# EAGLE schematic Crystal Filter (EAGLE 9.1.2)
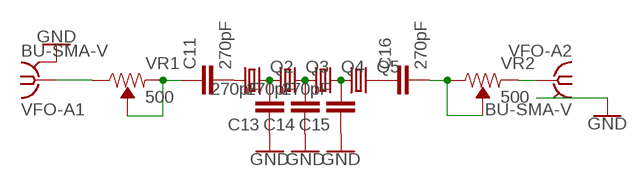
[diagram p0: schematic, sheet 1]

## Parts
C11  270pF  C5/3.5  [C5B3.5]
C13  270pF  C5/3.5  [C5B3.5]
C14  270pF  C5/3.5  [C5B3.5]
C15  270pF  C5/3.5  [C5B3.5]
C16  270pF  C5/3.5  [C5B3.5]
Q2  CRYTALHC49S  [HC49/S]
Q3  CRYTALHC49S  [HC49/S]
Q4  CRYTALHC49S  [HC49/S]
Q5  CRYTALHC49S  [HC49/S]
VFO-A1  BU-SMA-V  [BU-SMA-V]
VFO-A2  BU-SMA-V  [BU-SMA-V]
VR1  500  TRIMPOT-PTH-10MM-KNOB-1/2W-10%  [TRIMPOT-PTH-3386U]
VR2  500  TRIMPOT-PTH-10MM-KNOB-1/2W-10%  [TRIMPOT-PTH-3386U]

## Nets
GND: C13.1 C14.1 C15.1 VFO-A1.2 VFO-A1.3 VFO-A1.4 VFO-A1.5 VFO-A2.2 VFO-A2.3 VFO-A2.4 VFO-A2.5
N$1: C11.1 VR1.1(CCW) VR1.2(WIPER)
N$2: C16.2 VR2.2(WIPER) VR2.3(CW)
N$3: VFO-A2.1 VR2.1(CCW)
N$4: VFO-A1.1 VR1.3(CW)
N$12: C16.1 Q5.2
N$16: C11.2 Q2.1
N$17: C13.2 Q2.2 Q3.1
N$18: C14.2 Q3.2 Q4.1
N$19: C15.2 Q4.2 Q5.1

## Library data of the parts
C11 C13-C16 = capacitor-wima:C: CAPACITOR naming: grid - package width
Q2-Q5 = crystal:CRYTAL: CRYSTAL
VFO-A1 VFO-A2 = con-coax:BU-SMA-V: FEMALE SMA CONNECTOR Radiall distributor RS 112-3794; OC_FARNELL: unknown; OC_NEWARK: unknown
VR1 VR2 = SparkFun-Resistors:TRIMPOT: Trimming Potentiometer (Trimpot) Three-terminal potentiometers, with an adjustable wiper and two adjustable resistors. A pot can be used to create a configurable voltage divider, or as a variable resistor. "Trimpots" are a subset of potentiometers, usually intended for "set-and-forget" applications. They're often more delicate than standard potentiometers - rated for fewer turns. Variants PTH-KNOB - PTH Trimpot w/ finger-adjustable knob Trimpot 10K with Knob <https://www.sparkfun.com/products/9806> (COM-09806) Datasheet <http://www.sparkfun.com/datasheets/Components/General/TSR-3386.pdf> SMD-3MM-CLOSED-FRAME - SMD 3mm Square Closed-Frame Trimpot Used on e.g. EasyDriver - Stepper Motor Driver <https://www.sparkfun.com/products/12779> Datasheet <http://www.bitechnologies.com/pdfs/22.pdf> (22AR10KTR) SMD-5MM - SMD 5mm Square Closed-Frame Trimpot Used on e.g. IOIO-OTG - V2.2 <https://www.sparkfun.com/products/13613> Datasheet <http://www.vishay.com/docs/51008/ts53.pdf> (TS53YL502MR10) SMD-3MM-1/10W-25% - 3mm Square Open-Frame Trimpot Used on e.g. SparkFun Shapeoko <https://www.sparkfun.com/products/13899> Datasheet <http://www.bourns.com/docs/Product-Datasheets/TC33.pdf> (TC33X-2-103E); PROD_ID: RES-09730; SF_SKU: COM-09806; VALUE: 10k

## Net classes
0 default: width 0.762 mm, drill 0.762 mm, clearance 0.508 mm